# EasyEDA Pro project USB Hug.epro

# Schematic Schematic1
Board Name: Board1; Create Date: 2025-11-04; Page Name: P1; Project Name: USB Hug; Schematic Name: Schematic1; Update Date: 2025-11-08; Company: EasyEDA.com; Page Size: A4; Version: V1.0
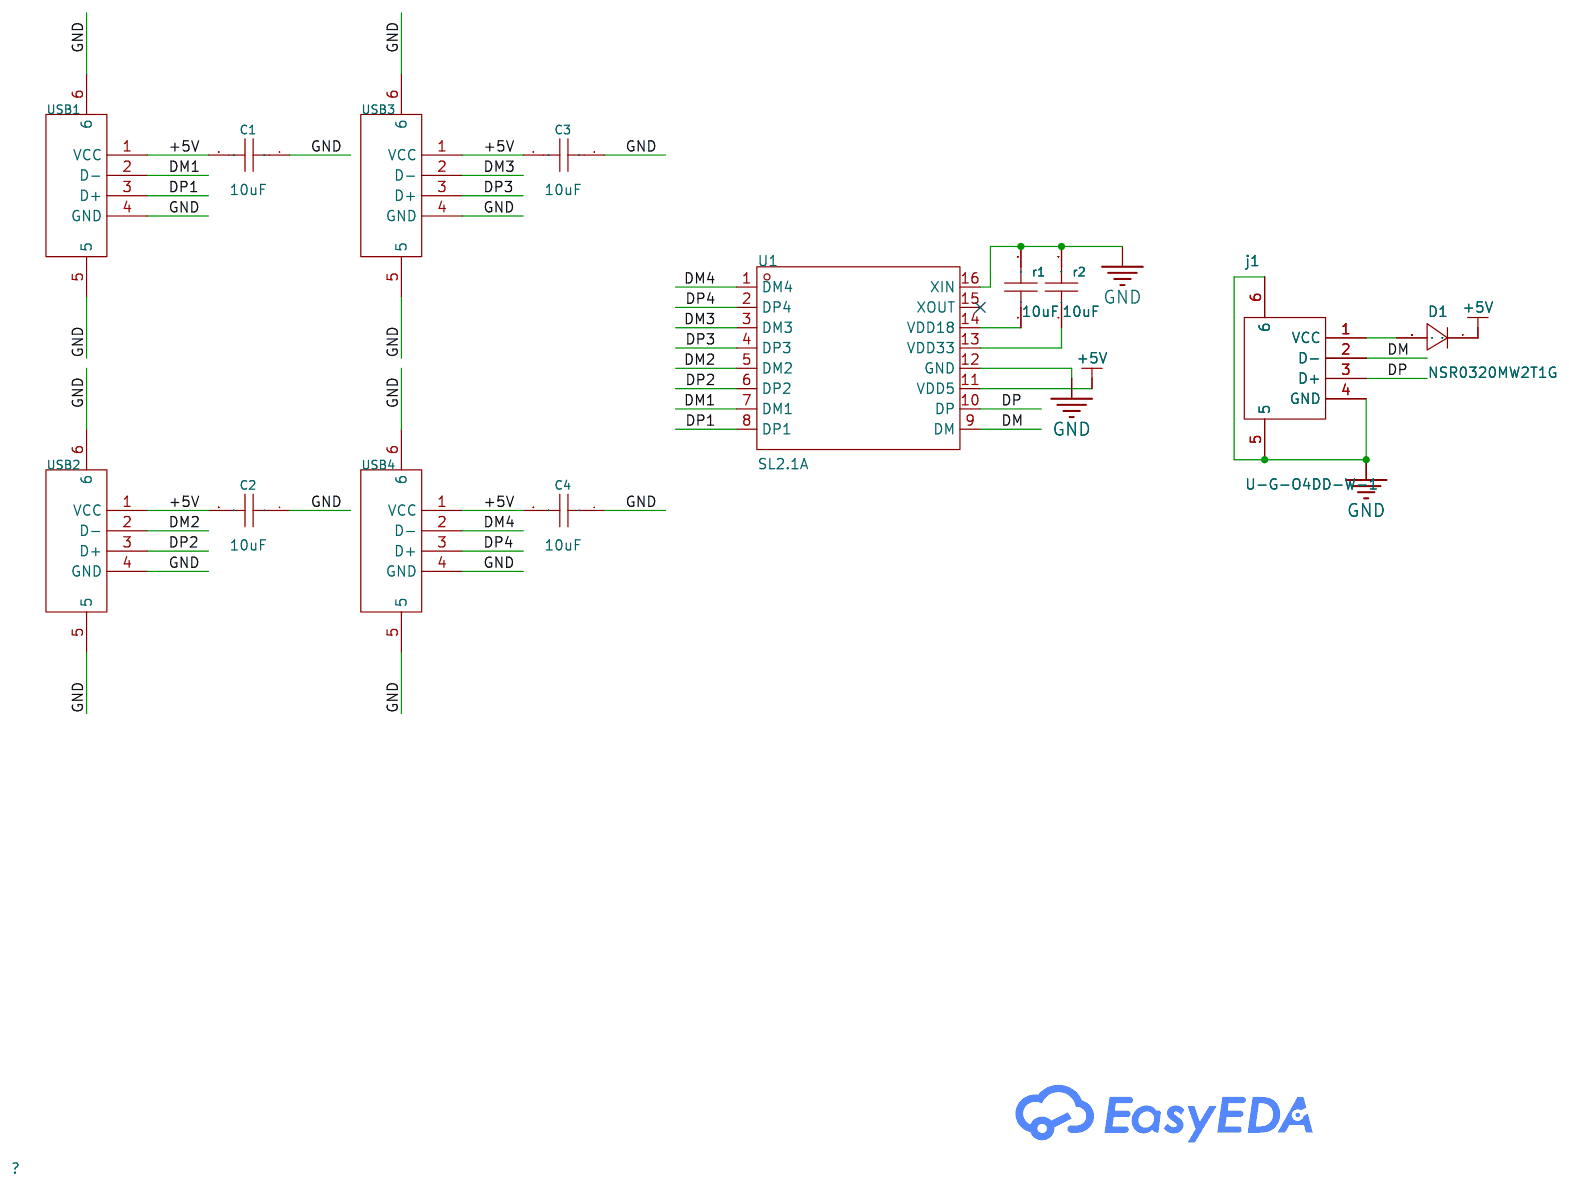
[diagram p0: schematic sheet]

## Parts
C1  10uF  [C0603]
C2  10uF  [C0603]
C3  10uF  [C0603]
C4  10uF  [C0603]
D1  NSR0320MW2T1G  [SOD-323_L1.8-W1.3-LS2.5-RD]
j1  U-G-O4DD-W-1  [USB-A-TH_U-G-04WD-W-01]
r1  10uF  [C0603]
r2  10uF  [C0603]
U1  SL2.1A  [SOP-16_L10.0-W3.9-P1.27-LS6.0-BL]
USB1  903-131A1011D10100  [USB-A-TH_C46407]
USB2  903-131A1011D10100  [USB-A-TH_C46407]
USB3  903-131A1011D10100  [USB-A-TH_C46407]
USB4  903-131A1011D10100  [USB-A-TH_C46407]

## Library data of the parts
C1-C4 r1 r2 = CL10A106MA8NRNC: Capacitance:10uF Tolerance:±20% Tolerance:±20% Voltage Rating:25V Temperature Coefficient:X5R; LCSC Part Name: 10uF ±20% 25V; Supplier Part: C96446; Manufacturer: SAMSUNG(三星); Supplier Footprint: 0603; Datasheet: https://item.szlcsc.com/datasheet/CL10A106MA8NRNC/97651.html; Supplier: LCSC; Tolerance: ±20%; Voltage Rating: 25V; Temperature Coefficient: X5R
D1 = NSR0320MW2T1G: Voltage - Forward(Vf@If):500mV@900mA Voltage - DC Reverse(Vr):20V Current - Rectified:1A Reverse Leakage Current (Ir):50uA@15V Operating Junction Temperature Range:-55℃~+125℃ Operating Junction Temperature Range:-55℃~+125℃ Non-Repetitive Peak Forward Surg; LCSC Part Name: 电压:20V 电流:1A; Supplier Part: C48192; Manufacturer: onsemi(安森美); Supplier Footprint: SOD-323; Datasheet: https://item.szlcsc.com/datasheet/NSR0320MW2T1G/49199.html; Supplier: LCSC; Voltage - Forward(Vf@If): 500mV@900mA; Voltage - DC Reverse(Vr): 20V; Current - Rectified: 1A; Reverse Leakage Current (Ir): 50uA@15V; Operating Junction Temperature Range: -55℃~+125℃; Non-Repetitive Peak Forward Surge Current: 5A
j1 = U-G-O4DD-W-1: Connector Type:Type-A Protocol Standard:USB 2.0 Gender:Male Number of Contacts:4P Number of Ports:1 Current Rating-Power:1A; LCSC Part Name: Type-A 公; Supplier Part: C98125; Manufacturer: 韩国韩荣; Supplier Footprint: 插件; Datasheet: https://item.szlcsc.com/datasheet/U-G-O4DD-W-1/99334.html; Supplier: LCSC; Connector Type: Type-A; Protocol Standard: USB 2.0; Gender: Male; Number of Contacts: 4P; Number of Ports: 1; Current Rating-Power: 1A
U1 = SL2.1A: type:Hub USB Protocol:USB 2.0 Voltage - Supply:4V~5.25V Voltage - Supply:4V~5.25V Operating Temperature:0℃~+70℃ Operating Temperature:0℃~+70℃ Current - Supply:120mA Supply Current (Iq):2.5mA Number of Channels:4; LCSC Part Name: USB2.0高速4端口HUB控制器; Supplier Part: C192893; Manufacturer: CoreChips(和芯润德); Supplier Footprint: SOP-16; Datasheet: https://item.szlcsc.com/datasheet/SL2.1A/225853.html; Supplier: LCSC; type: Hub; USB Protocol: USB 2.0; Voltage - Supply: 4V~5.25V; Operating Temperature: 0℃~+70℃; Current - Supply: 120mA; Supply Current (Iq): 2.5mA; Number of Channels: 4
USB1-USB4 = 903-131A1011D10100: Connector Type:Type-A Protocol Standard:USB 2.0 Gender:Female Number of Contacts:4P Number of Ports:1 Current Rating-Power:1.5A; LCSC Part Name: Type-A 母; Supplier Part: C46407; Manufacturer: 精拓金; Supplier Footprint: 插件; JLCPCB Part Class: Extended Part; Datasheet: https://item.szlcsc.com/datasheet/903-131A1011D10100/47411.html; Supplier: LCSC; Connector Type: Type-A; Protocol Standard: USB 2.0; Gender: Female; Number of Contacts: 4P; Number of Ports: 1; Current Rating-Power: 1.5A

## Nets
+5V: C1.2 C2.2 C3.2 C4.2 D1.1(C) U1.11(VDD5) USB1.1(VCC) USB2.1(VCC) USB3.1(VCC) USB4.1(VCC)
GND: C1.1 C2.1 C3.1 C4.1 j1.4(GND) j1.5 j1.6 r1.2 r2.2 U1.12(GND) U1.16(XIN) USB1.4(GND) USB1.5 USB1.6 USB2.4(GND) USB2.5 USB2.6 USB3.4(GND) USB3.5 USB3.6 USB4.4(GND) USB4.5 USB4.6
DM: j1.2(D-) U1.9(DM)
DM1: U1.7(DM1) USB1.2(D-)
DM2: U1.5(DM2) USB2.2(D-)
DM3: U1.3(DM3) USB3.2(D-)
DM4: U1.1(DM4) USB4.2(D-)
DP: j1.3(D+) U1.10(DP)
DP1: U1.8(DP1) USB1.3(D+)
DP2: U1.6(DP2) USB2.3(D+)
DP3: U1.4(DP3) USB3.3(D+)
DP4: U1.2(DP4) USB4.3(D+)
$1N1165: r1.1 U1.14(VDD18)
$1N1169: r2.1 U1.13(VDD33)
$1N1458: D1.2(A) j1.1(VCC)

Not connected (* = marked no-connect by the designer): U1 15(XOUT)*

# Board PCB1
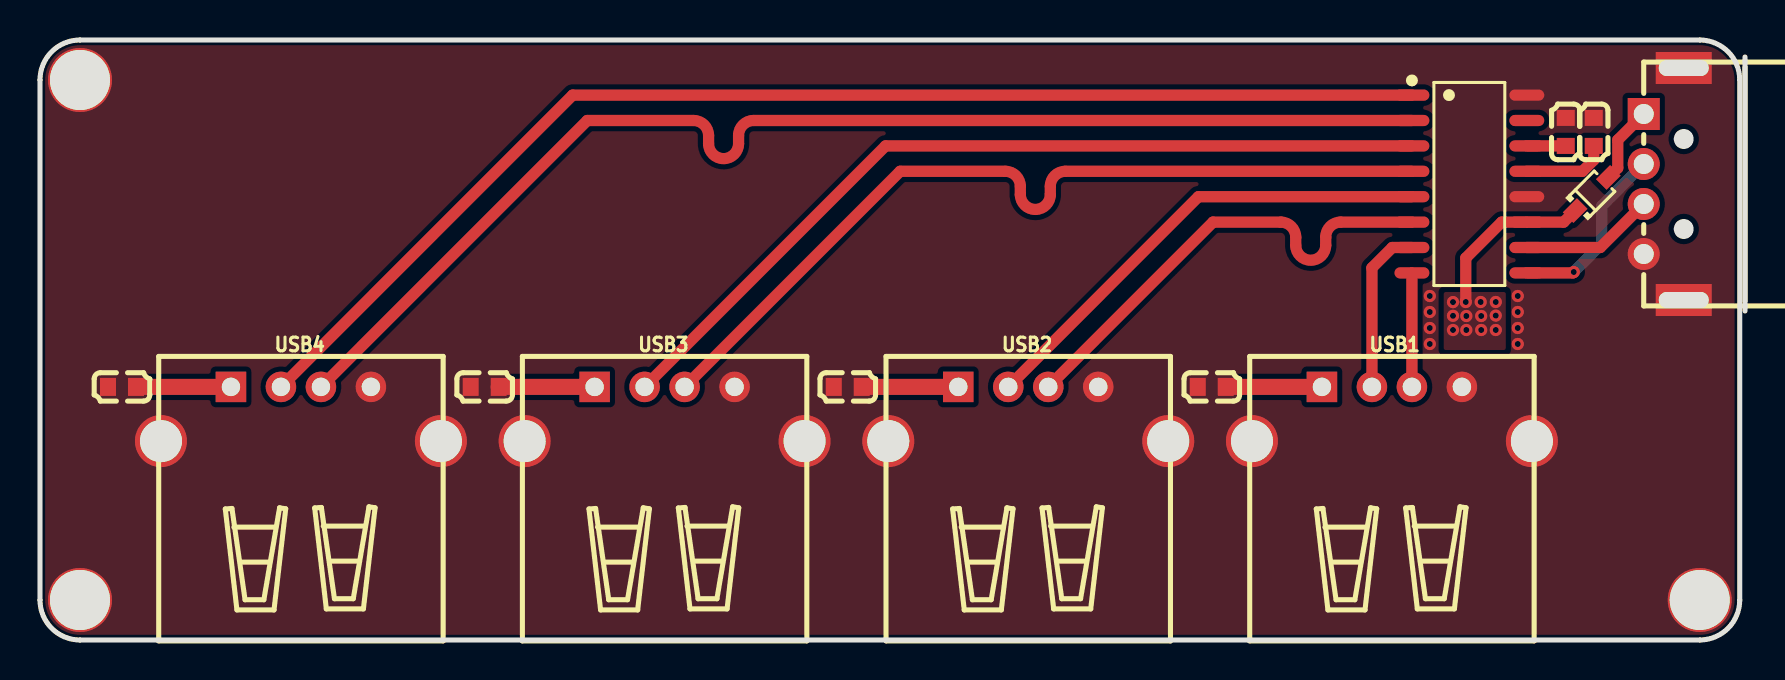
[diagram p1: board, top side]
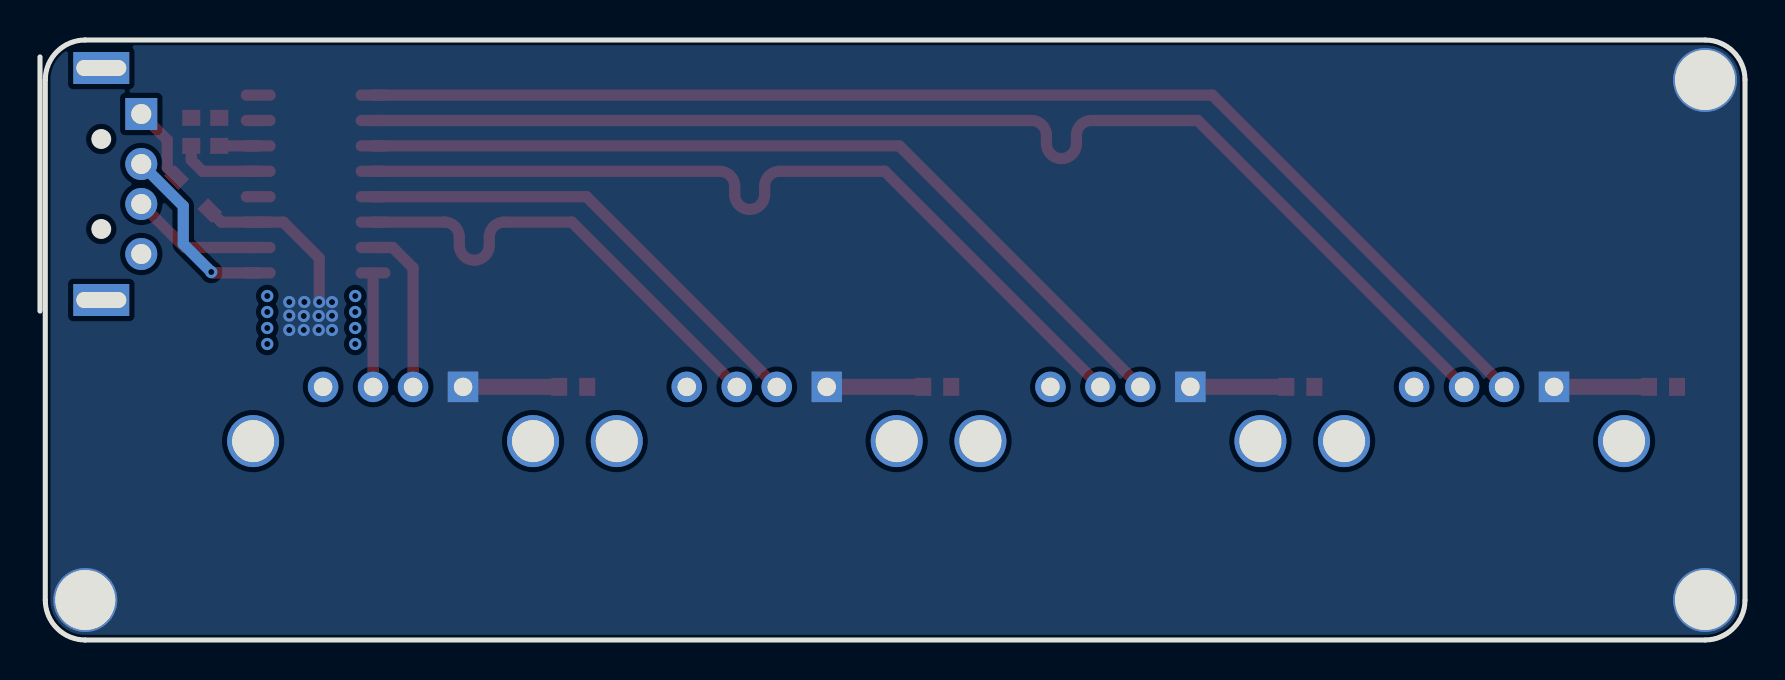
[diagram p2: board, bottom side, seen from below]

Outline 85.26 x 30 mm; copper layers: Top Layer, Bottom Layer. Coordinates in mm from the lower left corner of the outline.
Outline path: 0,28 0,2 arc(0.59,0.59) 2,0 83,0 arc(84.41,0.59) 85,2 85,28 arc(84.41,29.41) 83,30 2,30 arc(0.59,29.41) 0,28
Stack: Top Layer 0.035mm / Dielectric1 1.51mm FR4 er 4.5 / Bottom Layer 0.035mm

## Design rules (mm)
template: Custom Config
spacing copperThickness1oz (default): track to track 0.102, other pairs 0.152 to 0.3
spacing copperThickness2oz: track to track 0.203, other pairs 0.152 to 0.3
track width copperThickness1oz (default): min 0.127, default 0.56, max 0.56
track width copperThickness2oz: min 0.203, default 0.254, max 2.54
differential pair differentialPair (default): width min 0.127, default 0.254, max 2.54; gap min 0.152, default 0.152
via viaSize (default): diameter min 0.5, default 0.61, max 10; hole min 0.3, default 0.305, max 6.3

## Placement (name value [footprint] x y rotation side)
C1  10uF  [C0603]  58.6 12.66 0 top
C2  10uF  [C0603]  40.4 12.66 0 top
C3  10uF  [C0603]  22.24 12.66 0 top
C4  10uF  [C0603]  4.1 12.66 0 top
D1  NSR0320MW2T1G  [SOD-323_L1.8-W1.3-LS2.5-RD]  77.6 22.3 45 top
j1  U-G-O4DD-W-1  [USB-A-TH_U-G-04WD-W-01]  81.2 22.8 90 top
NOREF  -  [Pad_e350]  2 28 0 top
NOREF#2  -  [Pad_e351]  2 2 0 top
NOREF#3  -  [Pad_e352]  83 2 0 top
r1  10uF  [C0603]  76.3 25.41 90 top
r2  10uF  [C0603]  77.7 25.41 90 top
U1  SL2.1A  [SOP-16_L10.0-W3.9-P1.27-LS6.0-BL]  71.48 22.8 270 top
USB1  903-131A1011D10100  [USB-A-TH_C46407]  67.61 11.3 0 top
USB2  903-131A1011D10100  [USB-A-TH_C46407]  49.42 11.3 0 top
USB3  903-131A1011D10100  [USB-A-TH_C46407]  31.23 11.3 0 top
USB4  903-131A1011D10100  [USB-A-TH_C46407]  13.05 11.3 0 top

## Footprints (pads in the part's own frame, mm; a bottom-side part is the same pattern mirrored in y, then rotated)
C0603
  rect 0.8x0.9 smd: 1(-0.7,0) 2(0.7,0)
Pad_e350
  round 3.2 hole 3: 1(0,0)
Pad_e351
  round 3.2 hole 3: 2(0,0)
Pad_e352
  round 3.2 hole 3: 3(0,0)
SOD-323_L1.8-W1.3-LS2.5-RD
  rect 1x0.75 smd: 1(-1.173,0) 2(1.173,0)
SOP-16_L10.0-W3.9-P1.27-LS6.0-BL
  oval 0.56x1.745 smd: 1(-4.445,-2.873) 2(-3.175,-2.873) 3(-1.905,-2.873) 4(-0.635,-2.873) 5(0.635,-2.873) 6(1.905,-2.873) 7(3.175,-2.873) 8(4.445,-2.873) 9(4.445,2.873) 10(3.175,2.873) 11(1.905,2.873) 12(0.635,2.873) 13(-0.635,2.873) 14(-1.905,2.873) 15(-3.175,2.873) 16(-4.445,2.873)
USB-A-TH_C46407
  rect 1.524x1.524 hole 0.92: 1(-3.5,1.355)
  round 1.524 hole 0.92: 2(-1,1.355) 3(1,1.355) 4(3.5,1.355)
  round 2.6 hole 2.1: 5(7,-1.355) 6(-7,-1.355)
USB-A-TH_U-G-04WD-W-01
  rect 1.6x1.6 hole 1: 1(3.5,1)
  round 1.6 hole 1: 2(1,1) 3(-1,1) 4(-3.5,1)
  rect 1.6x2.8 hole 0.8x2.5: 5(5.8,-1) 6(-5.8,-1)

## Nets
As in the schematic, except:
GND: C1.1 C2.1 C3.1 C4.1 j1.4 j1.5 j1.6 NOREF.1 NOREF#2.2 NOREF#3.3 r1.2 r2.2 U1.12 U1.16 USB1.4 USB1.5 USB1.6 USB2.4 USB2.5 USB2.6 USB3.4 USB3.5 USB3.6 USB4.4 USB4.5 USB4.6

Pads without a net: U1 15

## Via types
v1: diameter 0.61, hole 0.305, Top Layer to Bottom Layer, 21 vias

## Routing (per net, layer and track width the routed paths; a pad name or vN(x,y) marks a point on that pad's centre or on a via; arc(x,y) is an arc through that point)
+5V: length 27.8
  Top Layer w0.56: v1(71.3,16.9) 71.3,19.1 73.1,20.89 U1.11 76.2,20.89 76.77,21.47
  Top Layer w0.8: C4.2 USB4.1 ; C2.2 USB2.1 ; C1.2 USB1.1 ; C3.2 USB3.1
  vias: v1(70.66,16.89) v1(70.66,16.21) v1(70.66,15.5) v1(71.33,16.2) v1(71.33,15.5) v1(72.05,16.9) v1(72.07,16.2) v1(72.07,15.5) v1(72.8,16.9) v1(72.8,16.22) v1(72.8,15.5)
GND:
  vias: v1(69.5,17.2) v1(69.5,16.4) v1(69.5,15.6) v1(69.5,14.8) v1(73.9,17.2) v1(73.9,16.4) v1(73.9,15.6) v1(73.9,14.8)
DM: length 9.2
  Top Layer w0.56: U1.9 76.66,18.36 v1(76.7,18.4)
  Bottom Layer w0.56: j1.2 78.1,21.7 78.1,19.8 v1(76.7,18.4)
DM1: length 8.4
  Top Layer w0.56: U1.7 67.63,19.62 66.61,18.61 USB1.2
DM2: length 24.1
  Top Layer w0.56: U1.5 57.93,22.16 USB2.2
DM3: length 43.4
  Top Layer w0.56: USB3.2 42.29,24.7 U1.3
DM4: length 62.6
  Top Layer w0.56: USB4.2 26.64,27.24 U1.1
DP: length 6.7
  Top Layer w0.56: U1.10 78.02,19.62 j1.3
DP1: length 5.7
  Top Layer w0.56: USB1.3 U1.8
DP2: length 24.1
  Top Layer w0.56: USB2.3 58.66,20.89 62.05,20.89 arc(62.58,20.68) 62.8,20.14 62.8,19.74 arc(63.55,18.99) 64.3,19.74 64.3,20.14 arc(64.52,20.68) 65.05,20.89 U1.6
DP3: length 43.4
  Top Layer w0.56: USB3.3 43.02,23.44 48.27,23.44 arc(48.8,23.22) 49.02,22.69 49.02,22.28 arc(49.77,21.53) 50.52,22.28 50.52,22.69 arc(50.74,23.22) 51.27,23.44 U1.4
DP4: length 62.6
  Top Layer w0.56: USB4.3 27.37,25.97 32.68,25.97 arc(33.21,25.76) 33.43,25.22 33.43,24.82 arc(34.18,24.07) 34.93,24.82 34.93,25.22 arc(35.15,25.76) 35.68,25.97 U1.2
$1N1165: length 1.9
  Top Layer w0.56: U1.14 r1.1
$1N1169: length 4.3
  Top Layer w0.56: r2.1 77.7,24 77.14,23.44 U1.13
$1N1458: length 3.9
  Top Layer w0.56: 78.43,23.13 78.9,23.6 78.9,25 j1.1

## Copper pours and planes (outline as drawn; the poured copper is in the pictures)
+5V on Top Layer: 70.2,17.4 73.3,17.4 73.3,14.5 70.2,14.5
+5V on Bottom Layer: 0,30 85,30 85,0 0,0
GND on Top Layer: 0,30 85,30 85,0 0,0
